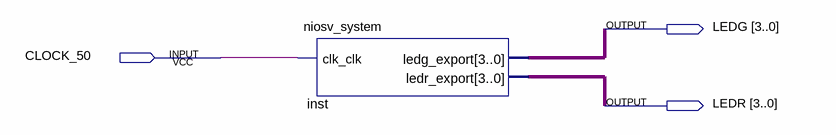
[diagram p0: schematic sheet]
// Quartus schematic niosv_top.bdf as structural Verilog: 1 symbols, 3 pins
module niosv_top (
  input  CLOCK_50,
  output [3:0] LEDG,
  output [3:0] LEDR
);

  niosv_system inst (.clk_clk(CLOCK_50), .ledg_export(LEDG), .ledr_export(LEDR));
endmodule
